# Altium project 210620_Corner_Board_R0.PrjPcb
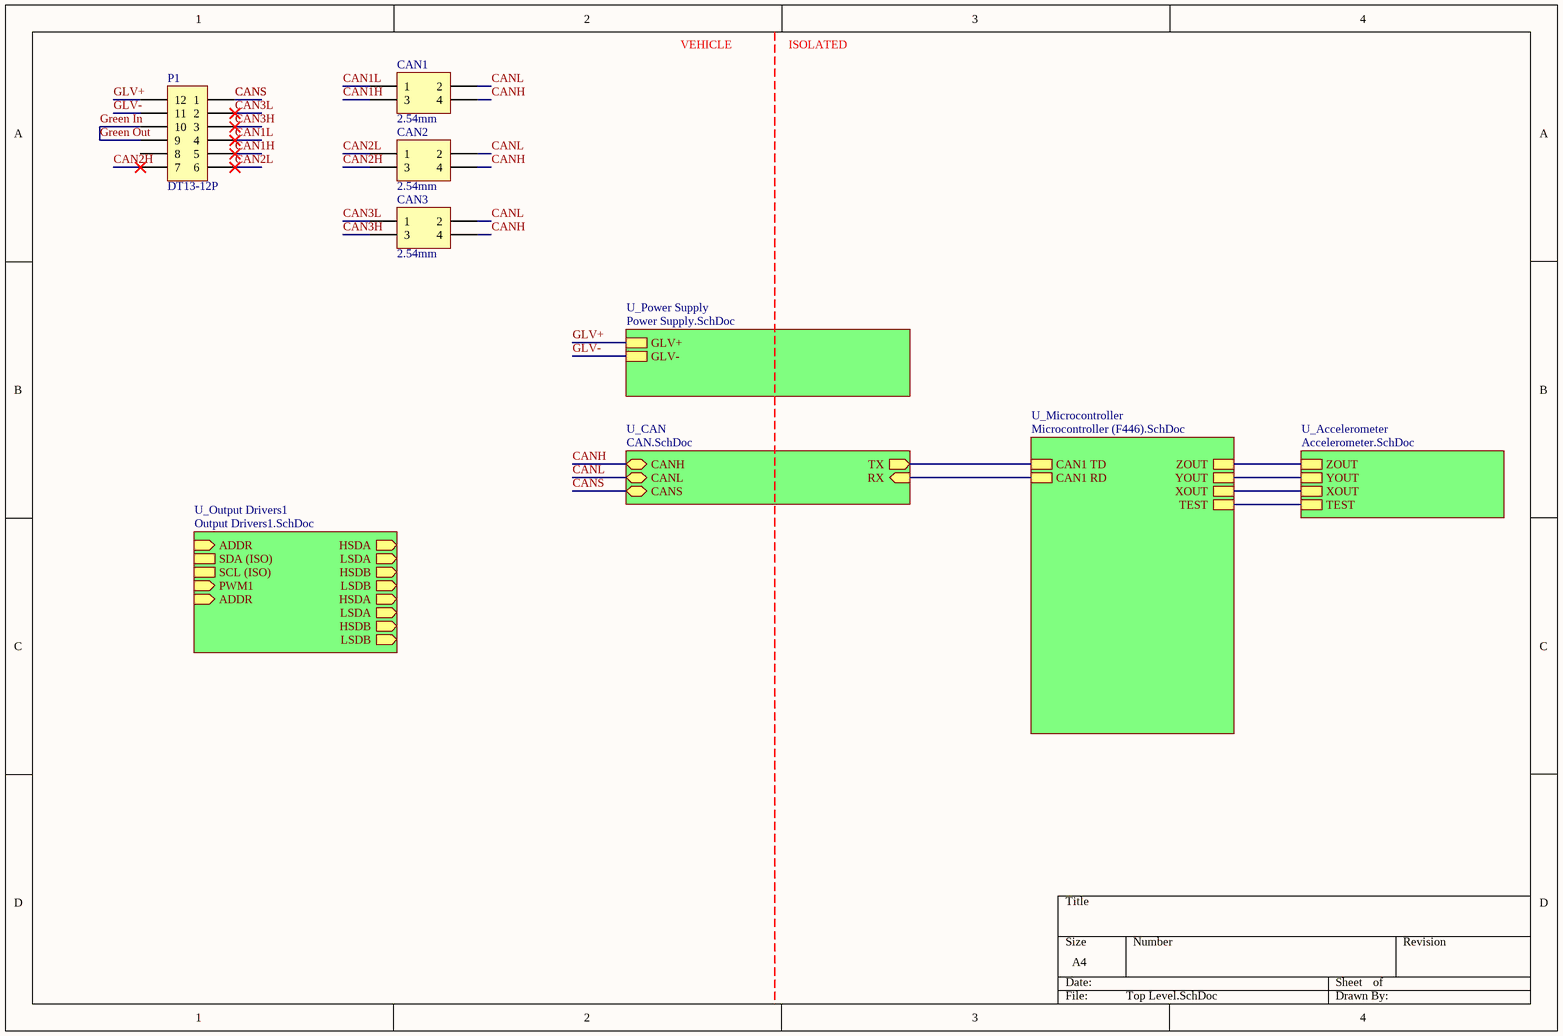
[diagram p0: Top Level.SchDoc]
6 sheets, 149 parts. Net scope: hierarchical (ports join the sheet entries above them; power ports are global).
Board file: 210627 CB R0.PcbDoc
Sheets:
  Top Level.SchDoc
    U_CAN = CAN.SchDoc
    U_Power Supply = Power Supply.SchDoc
    U_Microcontroller = Microcontroller (F446).SchDoc
    U_Accelerometer = Accelerometer.SchDoc
    U_Output Drivers1 = Output Drivers1.SchDoc

## Sheet Top Level.SchDoc
size A4; SheetNumber: 1; SheetTotal: 6

### Parts
CAN1  2.54mm  [TH 2.54mm Header 2x2]
CAN2  2.54mm  [TH 2.54mm Header 2x2]
CAN3  2.54mm  [TH 2.54mm Header 2x2]
P1  DT13-12P  [DT13-12P]

### Sub-sheets
U_Accelerometer = Accelerometer.SchDoc: ZOUT, XOUT, TEST, YOUT
U_CAN = CAN.SchDoc: CANS (bidir), RX (in), CANL (bidir), CANH (bidir), TX (out)
U_Microcontroller = Microcontroller (F446).SchDoc: CAN1 RD, CAN1 TD, ZOUT, XOUT, YOUT, TEST
U_Output Drivers1 = Output Drivers1.SchDoc: ADDR (in), HSDA (out), LSDA (out), HSDB (out), LSDB (out), SDA (ISO), SCL (ISO), PWM1 (in), HSDA (out), LSDA (out), HSDB (out), LSDB (out), ADDR (in)
U_Power Supply = Power Supply.SchDoc: GLV+, GLV-

### Nets
CANS: P1.1 ; sheet U_CAN/CANS
CAN1H: CAN1.3 P1.5
CAN1L: CAN1.1 P1.4
CAN2H: CAN2.3 P1.7
CAN2L: CAN2.1 P1.6
CAN3H: CAN3.3 P1.3
CAN3L: CAN3.1 P1.2
CANH: CAN1.4 CAN2.4 CAN3.4 ; sheet U_CAN/CANH
CANL: CAN1.2 CAN2.2 CAN3.2 ; sheet U_CAN/CANL
GLV+: P1.12 ; sheet U_Power Supply/GLV+
GLV-: P1.11 ; sheet U_Power Supply/GLV-
Green In: P1.9 P1.10  [also labelled Green Out]
NetTP15_1: sheet U_CAN/TX, sheet U_Microcontroller/CAN1 TD
NetTP16_1: sheet U_CAN/RX, sheet U_Microcontroller/CAN1 RD
NetU9_4: sheet U_Microcontroller/ZOUT, sheet U_Accelerometer/ZOUT
NetU9_5: sheet U_Microcontroller/YOUT, sheet U_Accelerometer/YOUT
NetU9_6: sheet U_Microcontroller/XOUT, sheet U_Accelerometer/XOUT
NetU9_7: sheet U_Microcontroller/TEST, sheet U_Accelerometer/TEST
NetU11_2: sheet U_Output Drivers1/LSDB, sheet U_Output Drivers1/LSDB
NetU11_11: sheet U_Output Drivers1/HSDB, sheet U_Output Drivers1/HSDB
NetU11_28: sheet U_Output Drivers1/LSDA, sheet U_Output Drivers1/LSDA
NetU13_11: sheet U_Output Drivers1/ADDR, sheet U_Output Drivers1/ADDR
(unnamed): sheet U_Output Drivers1/HSDA, sheet U_Output Drivers1/HSDA

Not connected (* = marked no-connect by the designer): P1 8

### Notes on the sheet
- VEHICLE
- ISOLATED

### Library data of the parts
CAN1-CAN3 = TH 2.54mm Header 2x2: Positions: 4; Angle: 0; Flange: No; Contact: NA; Part Number: TH 2.54mm Header 2x2; Pitch: 2.54mm; Row Spacing: 2.54mm
P1 = DT13-12P: Positions: 12; Pitch: 4.44mm; Row Spacing: 6.35mm; Angle: 90; Flange: Yes; Contact: Nickel; Part Number: DT13-12P; Digikey Part Number: 1734-1451-ND; Digikey Link: https://www.digikey.com.au/product-detail/en/te-connectivity-deutsch-connectors/DT13-12PA/1734-1451-ND/7220123

## Sheet CAN.SchDoc
size A4; SheetNumber: 3; SheetTotal: 6
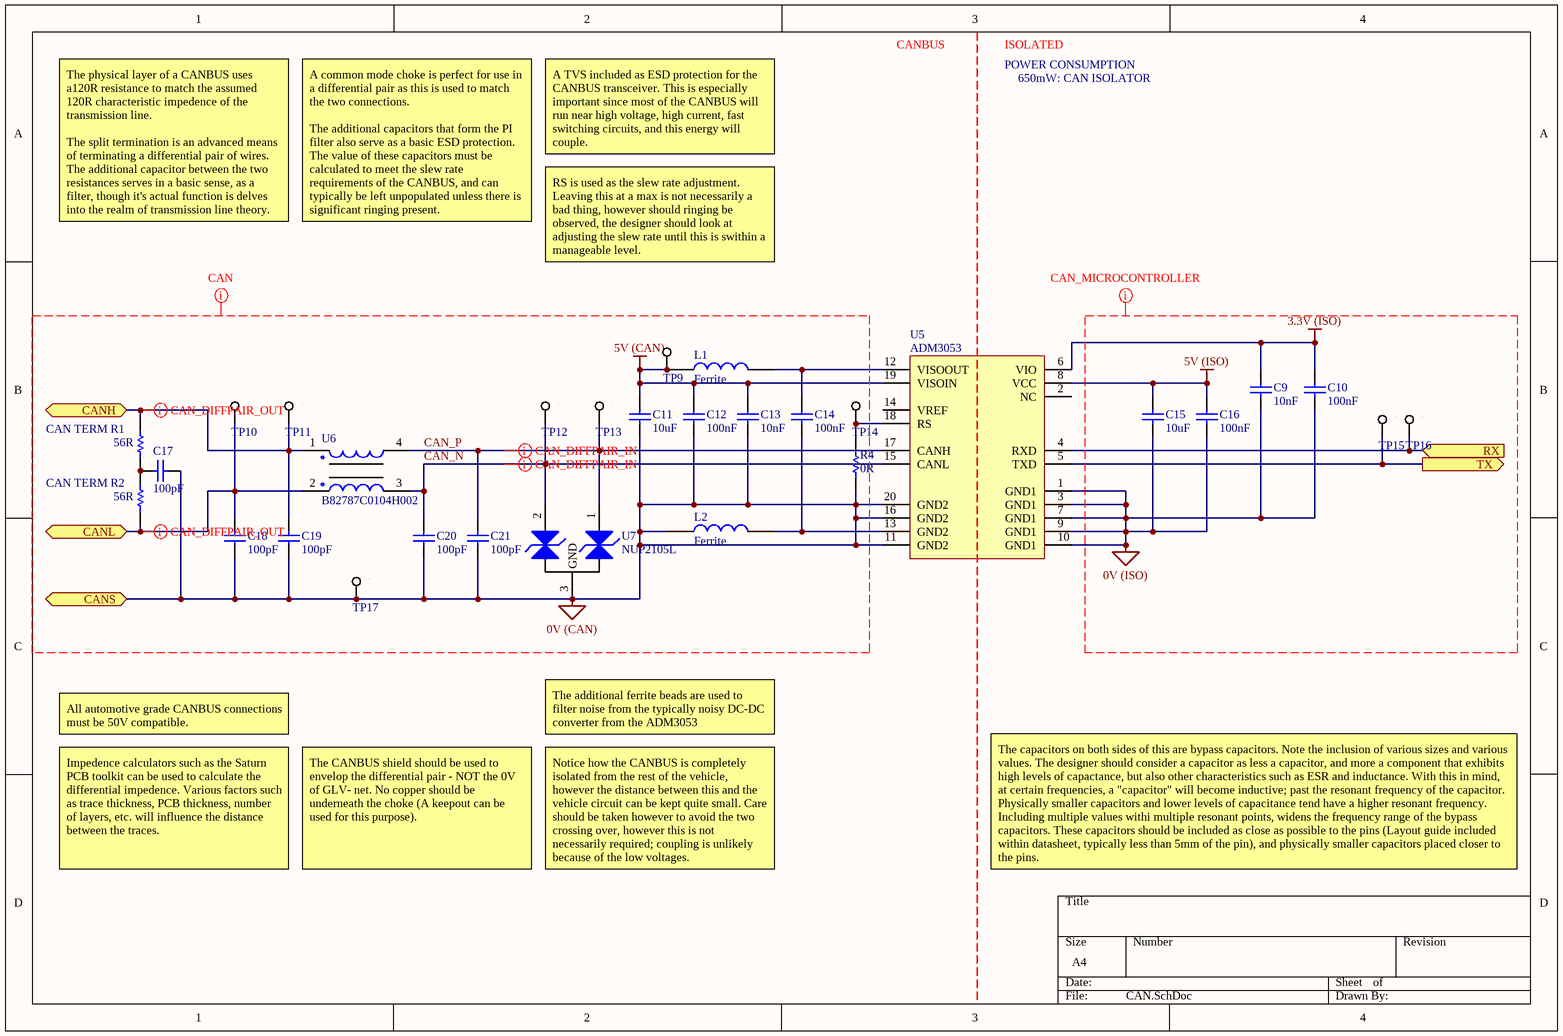
[diagram p1: CAN.SchDoc]

### Parts
(Parts that share a designator on the sheet are numbered #1, #2 ... from top to bottom, then left to right.)
C9  10nF  [1206]
C10  100nF  [0805]
C11  10uF  [0805]
C12  100nF  [0805]
C13  10nF  [1206]
C14  100nF  [0805]
C15  10uF  [0805]
C16  100nF  [0805]
C17  100pF  [0805]
C18  100pF  [0805]
C19  100pF  [0805]
C20  100pF  [0805]
C21  100pF  [0805]
CAN_TERM_R1  56R  [0805]
CAN_TERM_R2  56R  [0805]
L1  Ferrite  [0805]
L2  Ferrite  [0805]
R4#1  0R  [0805]
TP9  0mm  [SMD Test Point 1mm]  (value not drawn)
TP10  0mm  [SMD Test Point 1mm]  (value not drawn)
TP11  0mm  [SMD Test Point 1mm]  (value not drawn)
TP12  0mm  [SMD Test Point 1mm]  (value not drawn)
TP13  0mm  [SMD Test Point 1mm]  (value not drawn)
TP14  0mm  [SMD Test Point 1mm]  (value not drawn)
TP15  0mm  [SMD Test Point 1mm]  (value not drawn)
TP16  0mm  [SMD Test Point 1mm]  (value not drawn)
TP17  0mm  [SMD Test Point 1mm]  (value not drawn)
U5  ADM3053  [AD SOIC-W 20]
U6  B82787C0104H002  [TDK 4-PC Pad]
U7  NUP2105L  [ON SOT-23]

### Ports
CANH (bidir), CANL (bidir), CANS (bidir), RX (in), TX (out)

### Nets
0V (CAN): C11.1 C12.1 C13.1 C17.2 C18.1 C19.1 C20.1 C21.1 L2.2 R4#1.1 TP17.1 U5.11(GND2) U5.16(GND2) U5.20(GND2) U7.3(GND) ; port CANS  [project net CANS]
0V (ISO): C9.1 C10.1 C15.1 C16.1 U5.1(GND1) U5.3(GND1) U5.7(GND1) U5.9(GND1) U5.10(GND1)
3.3V (ISO): C9.2 C10.2 U5.6(VIO)
5V (CAN): C11.2 C12.2 C13.2 L1.2 TP9.1 U5.19(VISOIN)
5V (ISO): C15.2 C16.2 U5.8(VCC)
CAN_N: C20.2 TP12.1 U5.15(CANL) U6.3 U7.2(CAN_L)
CAN_P: C21.2 TP13.1 U5.17(CANH) U6.4 U7.1(CAN_H)
CANH: C19.2 CAN_TERM_R1.2 TP11.1 U6.1 ; port CANH
CANL: C18.2 CAN_TERM_R2.1 TP10.1 U6.2 ; port CANL
NetC14_1: C14.1 L2.1 U5.13(GND2)
NetC14_2: C14.2 L1.1 U5.12(VISOOUT)
NetC17_1: C17.1 CAN_TERM_R1.1 CAN_TERM_R2.2
NetR4#1_2: R4#1.2 TP14.1 U5.18(RS)
NetTP15_1: TP15.1 U5.5(TXD) ; port TX
NetTP16_1: TP16.1 U5.4(RXD) ; port RX

Not connected (* = marked no-connect by the designer): U5 2(NC) 14(VREF)

### Layout directives
net class CAN_NET: 0V (CAN), 5V (CAN), CAN_N, CAN_P
net class MICROCONTROLLER: 0V (ISO), 3.3V (ISO), 5V (ISO)
differential pair; differential pair class CAN_DIFFPAIR_IN: CAN_N, CAN_P
differential pair; differential pair class CAN_DIFFPAIR_OUT: CANH, CANL

### Notes on the sheet
- CANBUS
- ISOLATED
- POWER CONSUMPTION
- 650mW: CAN ISOLATOR
- A TVS included as ESD protection for the CANBUS transceiver. This is especially important since most of the CANBUS will run near high voltage, high current, fast switching circuits, and this energy will couple.
- The physical layer of a CANBUS uses a120R resistance to match the assumed 120R characteristic impedence of the transmission line.
  The split termination is an advanced means of terminating a differential pair of wires. The additional capacitor between the two resistances serves in a basic sense, as a filter, though it's actual function is delves into the realm of transmission line theory.
- A common mode choke is perfect for use in a differential pair as this is used to match the two connections.
  The additional capacitors that form the PI filter also serve as a basic ESD protection. The value of these capacitors must be calculated to meet the slew rate requirements of the CANBUS, and can typically be left unpopulated unless there is significant ringing present.
- RS is used as the slew rate adjustment. Leaving this at a max is not necessarily a bad thing, however should ringing be observed, the designer should look at adjusting the slew rate until this is swithin a manageable level.
- All automotive grade CANBUS connections must be 50V compatible.
- The additional ferrite beads are used to filter noise from the typically noisy DC-DC converter from the ADM3053
- Impedence calculators such as the Saturn PCB toolkit can be used to calculate the differential impedence. Various factors such as trace thickness, PCB thickness, number of layers, etc. will influence the distance between the traces.
- The CANBUS shield should be used to envelop the differential pair - NOT the 0V of GLV- net. No copper should be underneath the choke (A keepout can be used for this purpose).
- Notice how the CANBUS is completely isolated from the rest of the vehicle, however the distance between this and the vehicle circuit can be kept quite small. Care should be taken however to avoid the two crossing over, however this is not necessarily required; coupling is unlikely because of the low voltages.
- The capacitors on both sides of this are bypass capacitors. Note the inclusion of various sizes and various values. The designer should consider a capacitor as less a capacitor, and more a component that exhibits high levels of capactance, but also other characteristics such as ESR and inductance. With this in mind, at certain frequencies, a "capacitor" will become inductive; past the resonant frequency of the capacitor. Physically smaller capacitors and lower levels of capacitance tend have a higher resonant frequency. Including multiple values withi multiple resonant points, widens the frequency range of the bypass capacitors. These capacitors should be included as close as possible to the pins (Layout guide included within datasheet, typically less than 5mm of the pin), and physically smaller capacitors placed closer to the pins.

### Library data of the parts
C9 C13 = GCM3195C2A103JA16D: Manufacturer: muRata; Tolerance: 5%; Material: Ceramic; Rated Voltage: 100V; Part Number: GCM3195C2A103JA16D; Value: 10nF; Digikey Part Number: 490-4978-2-ND
C10 C12 C14 C16 = GCM21BR71E104KA37L: Manufacturer: muRata; Tolerance: 10%; Material: X7R; Rated Voltage: 25V; Part Number: GCM21BR71E104KA37L; Value: 100nF; Digikey Part Number: DO NOT USE FOR NEW DESIGNS
C11 C15 = GRM21BR6YA106KE43L: Manufacturer: muRata; Tolerance: 10%; Material: X5R; Rated Voltage: 50V; Part Number: GRM21BR6YA106KE43L; Value: 10uF; Digikey Part Number: 490-10514-6-ND
C17-C21 = GCM21B5C1H101JA37L: Manufacturer: muRata; Tolerance: 5%; Material: C0G; Rated Voltage: 50V; Part Number: GCM21B5C1H101JA37L; Value: 100pF; Digikey Part Number: DO NOT USE FOR NEW DESIGNS
CAN_TERM_R1 CAN_TERM_R2 = RC0805FR0756RL: Manufacturer: YAGEO; Tolerance: 0.01; Rated Voltage: 0.125W; Part Number: RC0805FR0756RL; Value: 56R; Material: FR-07; Digikey Part Number: 311-56.0CRCT-ND
L1 L2 = MMZ2012Y202BTD25: Manufacturer: TDK Corportation; Impedence: 2 kOhms @ 100MHz; Material: Ferrite Bead; Rated Current: 400mA; Part Number: MMZ2012Y202BTD25; Value: Ferrite; Digikey Part Number: 445-172872-1-ND
R4#1 = RC0805FR070RL: Manufacturer: YAGEO; Tolerance: 0.01; Rated Voltage: 0.125W; Part Number: RC0805FR070RL; Value: 0R; Material: FR-07; Digikey Part Number: 311-0.0CRCT-ND
TP9-TP17 = SMD Test Point Small: Positions: 1; Row Spacing: 0; Flange: No; Contact: NA; Part Number: SMD Test Point Small; Pitch: 0mm; Angle: 0
U5 = ADM3053: Isolated CAN Transceiver; Manufacturer: Analogue Devices; Part Number: ADM3053; Digikey Part Number: ADM3053BRWZ-ND; Digikey Link: https://www.digikey.com/product-detail/en/analog-devices-inc/ADM3053BRWZ/ADM3053BRWZ-ND/2709332
U6 = B82787C0104H002: 100µH @ 100kHz 2 Line Common Mode Choke Surface Mount 5.8 kOhms @ 10MHz 150mA DCR 2Ohm; Manufacturer: EPCOS (TDK); Part Number: B82787C0104H002; Impedence: 5.8 kOhms @ 10MHz; Material: Wirewound; Rated Current: 150mA; Digikey Part Number: 495-4598-1-ND; Digikey Link: https://www.digikey.com/product-detail/en/epcos-tdk/B82787C0104H002/495-4598-2-ND/3680998; Value: 100µH @ 100kHz
U7 = NUP2105L: Dual Line CAN Bus Protector; Manufacturer: ON Semiconductor; Part Number: NUP2105L; Digikey Part Number: NUP2105LT1GOSCT-ND; Digikey Link: https://www.digikey.com/product-detail/en/on-semiconductor/NUP2105LT1G/NUP2105LT1GOSCT-ND/1485001

## Sheet Power Supply.SchDoc
size A4; SheetNumber: 2; SheetTotal: 6
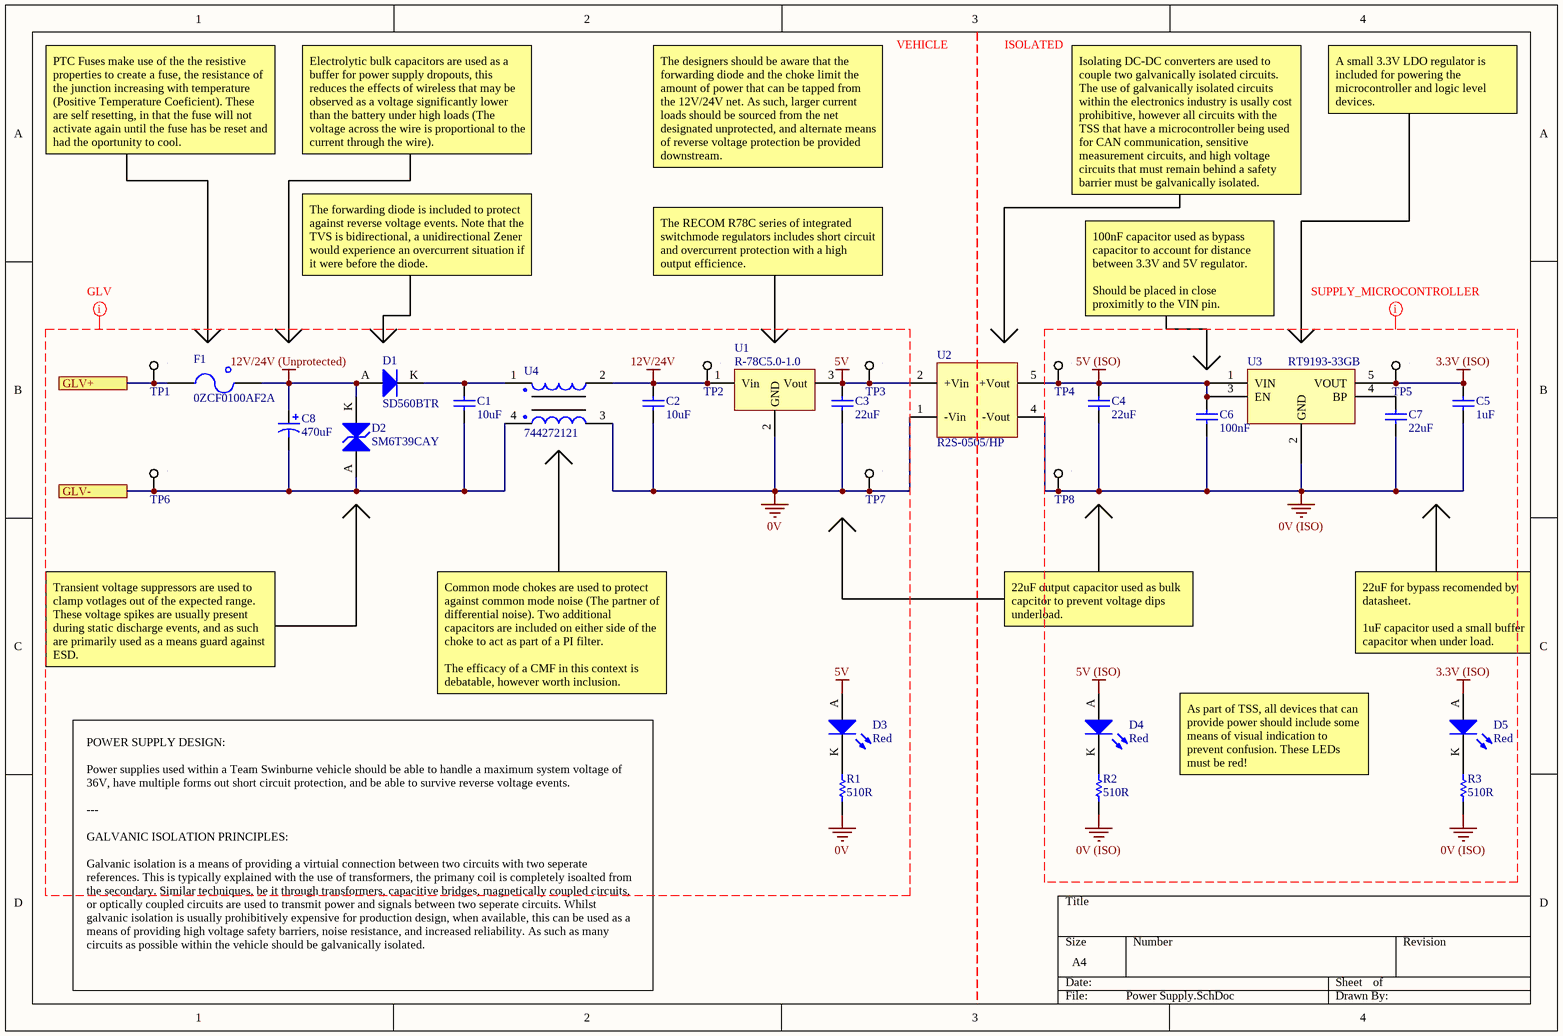
[diagram p2: Power Supply.SchDoc]

### Parts
(Parts that share a designator on the sheet are numbered #1, #2 ... from top to bottom, then left to right.)
C1  10uF  [0805]
C2  10uF  [0805]
C3  22uF  [1206]
C4  22uF  [1206]
C5  1uF  [0805]
C6  100nF  [0805]
C7  22uF  [1206]
C8  470uF  [Vishay Radial 1616]
D1  SD560BTR  [SMB Diode]
D2  SM6T39CAY  [ST SMB Diode]
D3  Red  [0805 LED]
D4  Red  [0805 LED]
D5#1  Red  [0805 LED]
F1  0ZCF0100AF2A  [2920]
R1  510R  [0805]
R2  510R  [0805]
R3  510R  [0805]
TP1  0mm  [SMD Test Point 1mm]  (value not drawn)
TP2  0mm  [SMD Test Point 1mm]  (value not drawn)
TP3  0mm  [SMD Test Point 1mm]  (value not drawn)
TP4  0mm  [SMD Test Point 1mm]  (value not drawn)
TP5  0mm  [SMD Test Point 1mm]  (value not drawn)
TP6  0mm  [SMD Test Point 1mm]  (value not drawn)
TP7  0mm  [SMD Test Point 1mm]  (value not drawn)
TP8  0mm  [SMD Test Point 1mm]  (value not drawn)
U1  R-78C5.0-1.0  [RECOM 3-SIP]
U2  R2S-0505/HP  [RECOM 8-SMD (5 Pin)]
U3  RT9193-33GB  [RICHTEK SOT-23-5]
U4  744272121  [Wurth 4-PC Pad]

### Ports
GLV+, GLV-

### Nets
0V: C2.1 C3.1 R1.1 TP7.1 U1.2(GND) U2.1(-Vin) U4.3
0V (ISO): C4.1 C5.1 C6.1 C7.1 R2.1 R3.1 TP8.1 U2.4(-Vout) U3.2(GND)
3.3V (ISO): C5.2 D5#1.A TP5.1 U3.5(VOUT)
5V: C3.2 D3.A TP3.1 U1.3(Vout) U2.2(+Vin)
5V (ISO): C4.2 C6.2 D4.A TP4.1 U2.5(+Vout) U3.1(VIN) U3.3(EN)
12V/24V: C2.2 TP2.1 U1.1(Vin) U4.2
12V/24V (Unprotected): C8.2 D1.A D2.K F1.2
GLV+: F1.1 TP1.1 ; port GLV+
GLV-: C1.1 C8.1 D2.A TP6.1 U4.4 ; port GLV-
NetC1_2: C1.2 D1.K U4.1
NetC7_2: C7.2 U3.4(BP)
NetD3_K: D3.K R1.2
NetD4_K: D4.K R2.2
NetD5#1_K: D5#1.K R3.2

### Layout directives
net class GLV: 0V, 5V, 12V/24V, 12V/24V (Unprotected)
net class MICROCONTROLLER: 0V (ISO), 3.3V (ISO), 5V (ISO)

### Notes on the sheet
- VEHICLE
- ISOLATED
- A small 3.3V LDO regulator is included for powering the microcontroller and logic level devices.
- PTC Fuses make use of the the resistive properties to create a fuse, the resistance of the junction increasing with temperature (Positive Temperature Coeficient). These are self resetting, in that the fuse will not activate again until the fuse has be reset and had the oportunity to cool.
- Electrolytic bulk capacitors are used as a buffer for power supply dropouts, this reduces the effects of wireless that may be observed as a voltage significantly lower than the battery under high loads (The voltage across the wire is proportional to the current through the wire).
- The designers should be aware that the forwarding diode and the choke limit the amount of power that can be tapped from the 12V/24V net. As such, larger current loads should be sourced from the net designated unprotected, and alternate means of reverse voltage protection be provided downstream.
- Isolating DC-DC converters are used to couple two galvanically isolated circuits.
  The use of galvanically isolated circuits within the electronics industry is usally cost prohibitive, however all circuits with the TSS that have a microcontroller being used for CAN communication, sensitive measurement circuits, and high voltage circuits that must remain behind a safety barrier must be galvanically isolated.
- The forwarding diode is included to protect against reverse voltage events. Note that the TVS is bidirectional, a unidirectional Zener would experience an overcurrent situation if it were before the diode.
- The RECOM R78C series of integrated switchmode regulators includes short circuit and overcurrent protection with a high output efficience.
- 100nF capacitor used as bypass capacitor to account for distance between 3.3V and 5V regulator.
  Should be placed in close proximitly to the VIN pin.
- 22uF output capacitor used as bulk capcitor to prevent voltage dips underload.
- 22uF for bypass recomended by datasheet.
  1uF capacitor used a small buffer capacitor when under load.
- Transient voltage suppressors are used to clamp votlages out of the expected range. These voltage spikes are usually present during static discharge events, and as such are primarily used as a means guard against ESD.
- Common mode chokes are used to protect against common mode noise (The partner of differential noise). Two additional capacitors are included on either side of the choke to act as part of a PI filter.
  The efficacy of a CMF in this context is debatable, however worth inclusion.
- As part of TSS, all devices that can provide power should include some means of visual indication to prevent confusion. These LEDs must be red!
- POWER SUPPLY DESIGN:
  Power supplies used within a Team Swinburne vehicle should be able to handle a maximum system voltage of 36V, have multiple forms out short circuit protection, and be able to survive reverse voltage events.
  ---
  GALVANIC ISOLATION PRINCIPLES:
  Galvanic isolation is a means of providing a virtuial connection between two circuits with two seperate references. This is typically explained with the use of transformers, the primany coil is completely isoalted from the secondary. Similar techniques, be it through transformers, capacitive bridges, magnetically coupled circuits, or optically coupled circuits are used to transmit power and signals between two seperate circuits. Whilst galvanic isolation is usually prohibitively expensive for production design, when available, this can be used as a means of providing high voltage safety barriers, noise resistance, and increased reliability. As such as many circuits as possible within the vehicle should be galvanically isolated.

### Library data of the parts
C1 C2 = GRM21BR6YA106KE43L: as C11 on sheet CAN; Part Number: GRM21BR6YA106KE43L; Value: 10uF; Digikey Part Number: 490-10514-6-ND
C3 C4 C7 = CC1206MKX5R7BB226: Manufacturer: YAGEO; Tolerance: 20%; Material: Ceramic; Rated Voltage: 16V; Part Number: CC1206MKX5R7BB226; Value: 22uF; Digikey Part Number: 311-1997-2-ND
C5 = AC0805KKX7R8BB105: Manufacturer: YAGEO; Tolerance: 10%; Material: X7R; Rated Voltage: 25V; Part Number: AC0805KKX7R8BB105; Value: 1uF; Digikey Part Number: DO NOT USE FOR NEW DESIGNS
C6 = GCM21BR71E104KA37L: as C10 on sheet CAN; Part Number: GCM21BR71E104KA37L; Value: 100nF; Digikey Part Number: DO NOT USE FOR NEW DESIGNS
C8 = MAL214699108E3: Manufacturer: Vishay; Tolerance: 20%; Material: Aluminium Electrolytic; Rated Voltage: 50V; Part Number: MAL214699108E3; Value: 470uF; Digikey Part Number: 4442PHCT-ND
D1 = SD560BTR: 1.2V_F 600V 5A SMB; Manufacturer: SMC Diode Solutions; Part Number: SD560BTR; Digikey Part Number: 1655-1530-2-ND; Digikey Link: https://www.digikey.com/product-detail/en/smc-diode-solutions/SD560BTR/1655-1530-2-ND/6022620
D2 = SM6T39CAY: 42.8V Clamp 93A (8/20µs) Ipp Tvs Diode Surface Mount SMB (DO-214AA); Manufacturer: ST; Vf: 42.8; Part Number: SM6T39CAY; Vbr: 42.8V; Digikey Part Number: SM6T39CAY; Digikey Link: https://www.digikey.com/en/products/detail/stmicroelectronics/SM6T39CAY/2442903; Alternative Parts: https://www.digikey.com/en/products/detail/stmicroelectronics/SM6T39AY/2442901
D3 D4 D5#1 = SML-210LTT86: Red LED Indication - Discrete 1.75V 0805 (2012 Metric); Manufacturer: ROHM Semiconductor; Part Number: SML-210LTT86; Colour: Red; Digikey Part Number: 511-1286-1-ND; Digikey Link: https://www.digikey.com/product-detail/en/rohm-semiconductor/SML-210LTT86/511-1286-1-ND/637099
F1 = 0ZCF0100AF2A: PTC RESET FUSE 60V 1A 292; Manufacturer: Littelfuse Inc.; Part Number: 0ZCF0100AF2A; Digikey Part Number: 507-2070-1-ND; Digikey Link: https://www.digikey.com/product-detail/en/bel-fuse-inc/0ZCF0100AF2A/507-2070-1-ND/6210547
R1-R3 = RC0805FR07510RL: Manufacturer: YAGEO; Tolerance: 0.01; Rated Voltage: 0.125W; Part Number: RC0805FR07510RL; Value: 510R; Material: FR-07; Digikey Part Number: 311-510CRCT-ND
TP1-TP8 = SMD Test Point Small: as TP9 on sheet CAN; Part Number: SMD Test Point Small; Pitch: 0mm; Angle: 0
U1 = R-78C5.0-1.0: CONV DC/DC 1A 5V OUT SIP VERT; Manufacturer: Recom; Isolation: Non-Isolated; Output Power: 5W; Part Number: R-78C5.0-1.0; Digikey Part Number: 945-1395-5-ND; Digikey Link: https://www.digikey.com.au/product-detail/en/recom-power/R-78C5.0-1.0/945-1395-5-ND/2652148; Output Voltage: 5V
U2 = R2S-0505/HP: Isolated Module DC DC Converter 1 Output 3.3V 606mA 4.5V - 5.5V Input; Manufacturer: Recom; Output Voltage: 5V; Output Power: 2W; Efficiency: 0.85; Part Number: R2S-0505/HP; Input Voltage: 4.5V-5.5V; Isolation: Isolated; Digikey Part Number: 945-1764-5-ND; Digikey Link: https://www.digikey.com/product-detail/en/recom-power/R2S-0505-HP/945-1764-5-ND/2302761
U3 = RT9193-33GB: Linear Voltage Regulator IC 1 Output 300mA SOT-23-5; Manufacturer: Richtek; Input Voltage: 5.5V-0.3V; Output Voltage: 3.3V; Output Power: 1W; Efficiency: 0.5; Isolation: Non-Isolated; Part Number: RT9193-33GB; Digikey Part Number: 1028-1014-1-ND; Digikey Link: https://www.digikey.com/products/en?keywords=1028-1014-1-ND
U4 = 744272121: 120µH @ 100kHz 2 Line Common Mode Choke Surface Mount 460 Ohms @ 30MHz 2.5A DCR 25mOhm; Manufacturer: Wurth Electronics Inc; Value: 120uH @ 100kHz; Part Number: 744272121; Impedence: 460 Ohms @ 30MHz; Material: Wirewound; Rated Current: 2.5A; Digikey Part Number: 732-1489-1-ND; Digikey Link: https://www.digikey.com/product-detail/en/w-rth-elektronik/744272121/732-1489-1-ND/1639501

## Sheet Microcontroller (F446).SchDoc
size A3; SheetNumber: 4; SheetTotal: 6
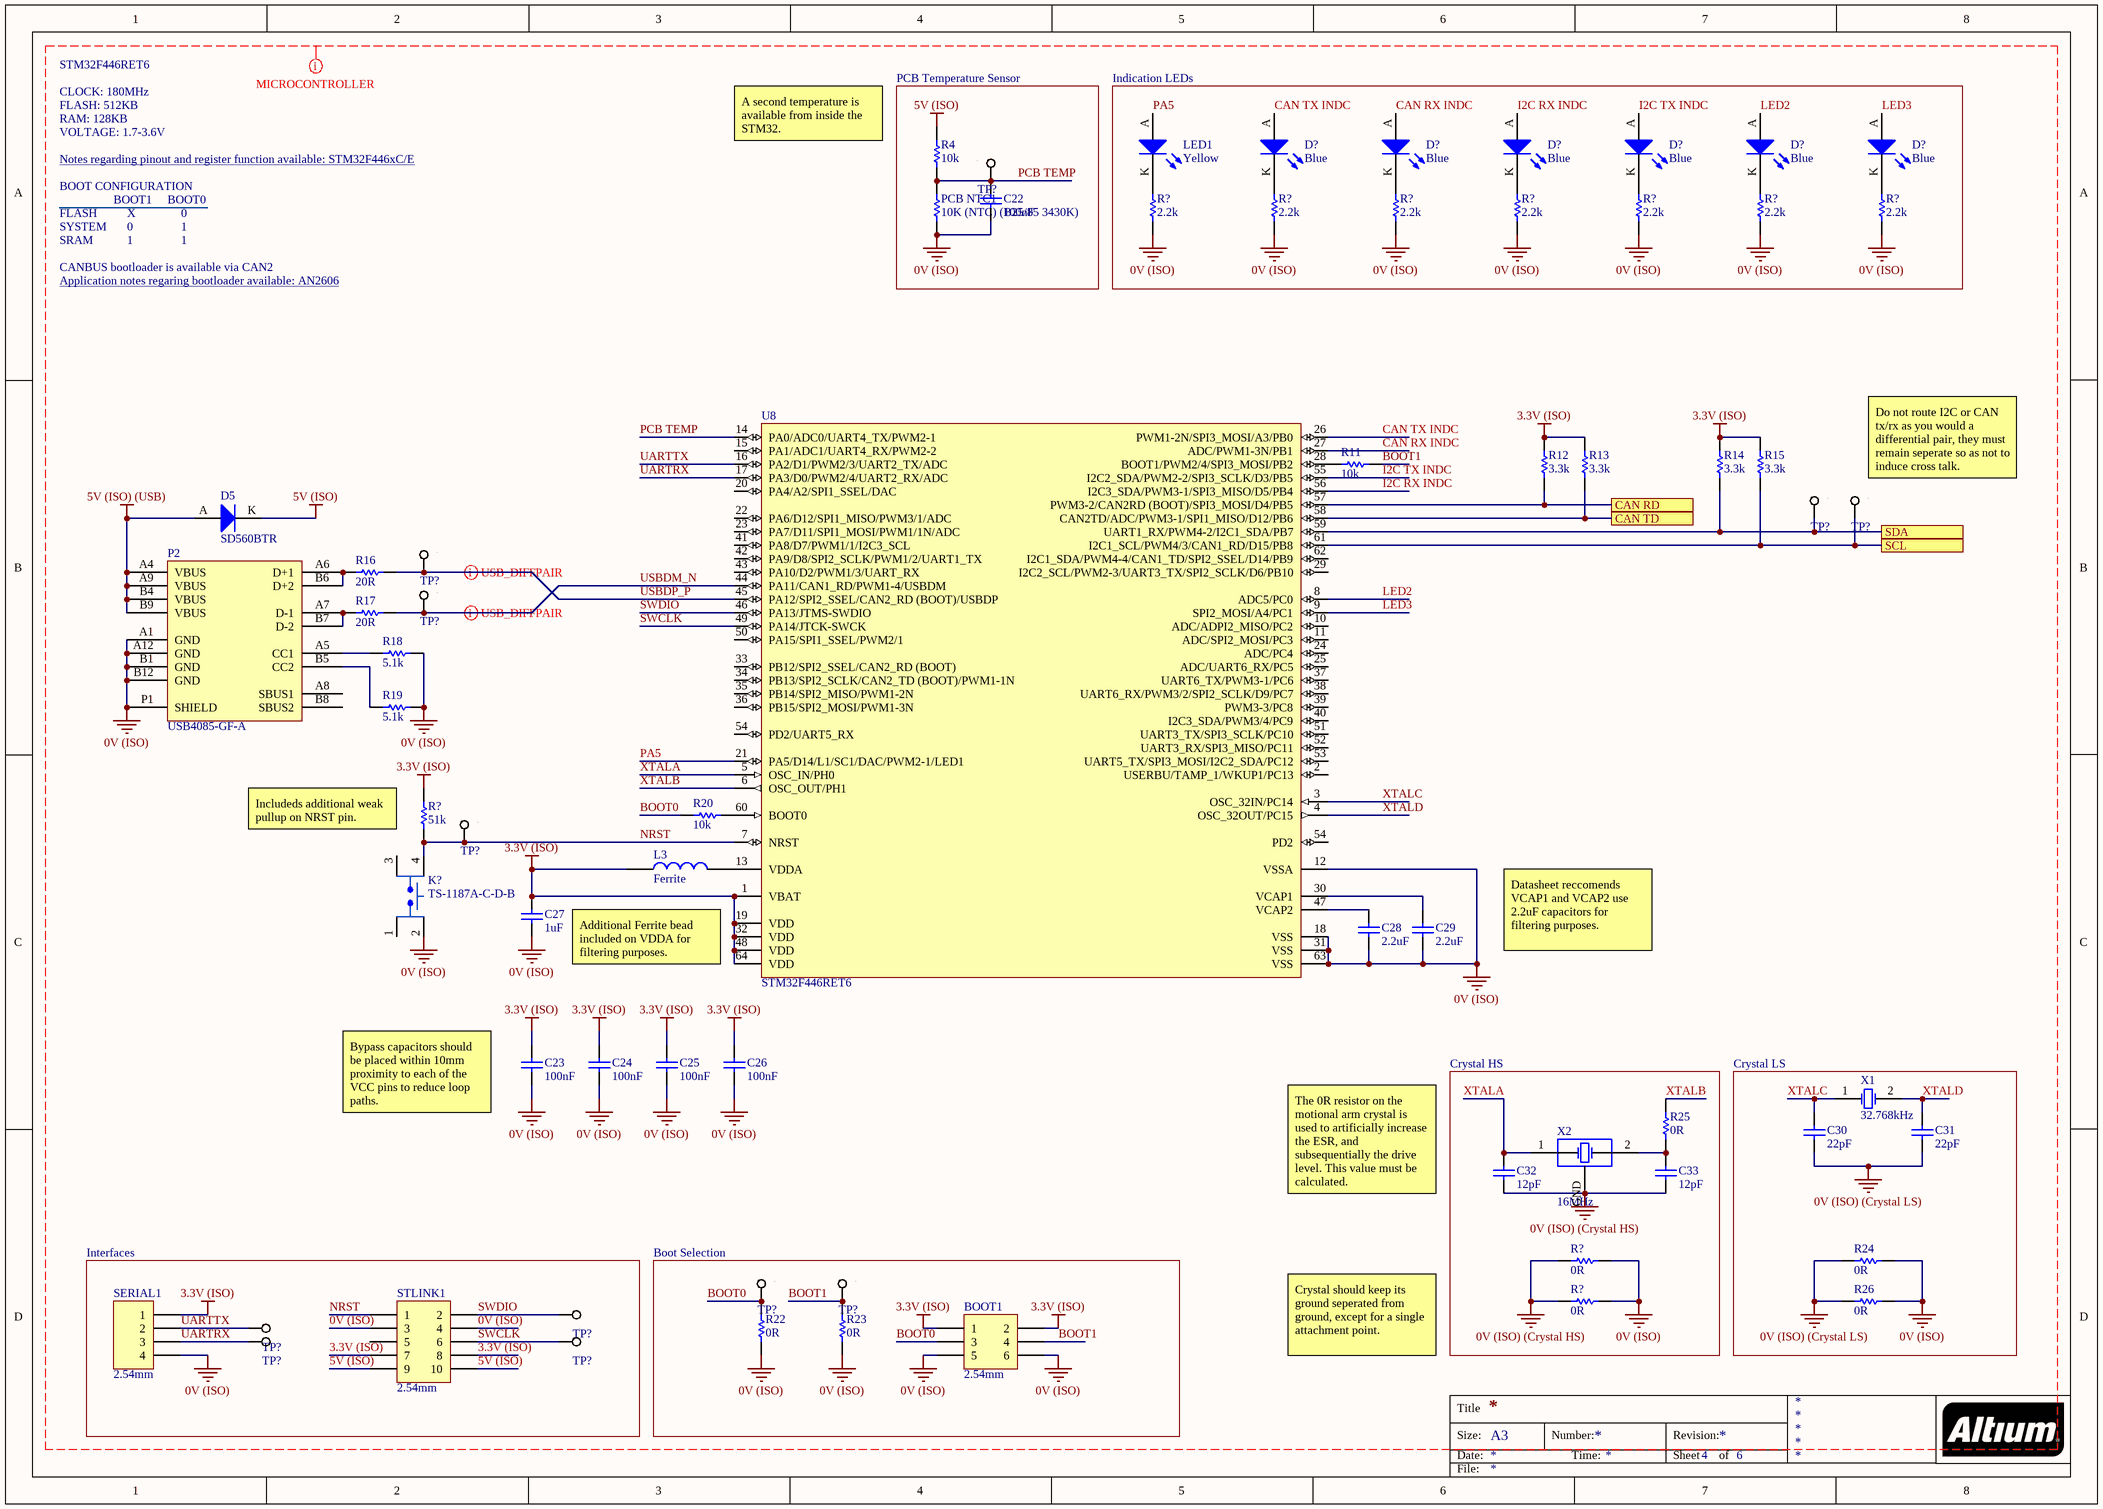
[diagram p3: Microcontroller (F446).SchDoc]

### Parts
(Parts that share a designator on the sheet are numbered #1, #2 ... from top to bottom, then left to right.)
BOOT1  2.54mm  [TH 2.54mm Header 2x3]
C22  100nF  [0805]
C23  100nF  [0805]
C24  100nF  [0805]
C25  100nF  [0805]
C26  100nF  [0805]
C27  1uF  [0805]
C28  2.2uF  [0805]
C29  2.2uF  [0805]
C30  22pF  [0805]
C31  22pF  [0805]
C32  12pF  [0805]
C33  12pF  [0805]
D5#2  SD560BTR  [SMB Diode]
D?#1  Blue  [0805 LED]
D?#2  Blue  [0805 LED]
D?#3  Blue  [0805 LED]
D?#4  Blue  [0805 LED]
D?#5  Blue  [0805 LED]
D?#6  Blue  [0805 LED]
K?  TS-1187A-C-D-B  [XKB SW-4.5]
L3  Ferrite  [0805]
LED1  Yellow  [0805 LED]
P2  USB4085-GF-A  [USB4085-GF-A]
PCB_NTC1  10K (NTC) (B25/85 3430K)  [0805]
R4#2  10k  [0805]
R11  10k  [0805]
R12  3.3k  [0805]
R13  3.3k  [0805]
R14  3.3k  [0805]
R15  3.3k  [0805]
R16  20R  [0805]
R17  20R  [0805]
R18  5.1k  [0805]
R19  5.1k  [0805]
R20  10k  [0805]
R22  0R  [0805]
R23  0R  [0805]
R24  0R  [0805]
R25  0R  [0805]
R26  0R  [0805]
R?#1  2.2k  [0805]
R?#2  2.2k  [0805]
R?#3  2.2k  [0805]
R?#4  2.2k  [0805]
R?#5  2.2k  [0805]
R?#6  2.2k  [0805]
R?#7  2.2k  [0805]
R?#8  51k  [0805]
R?#9  0R  [0805]
R?#10  0R  [0805]
SERIAL1  2.54mm  [TH 2.54mm Header 1x4]
STLINK1  2.54mm  [TH 2.54mm Header 2x5]
TP?#1  0mm  [SMD Test Point 1mm]  (value not drawn)
TP?#2  0mm  [SMD Test Point 1mm]  (value not drawn)
TP?#3  0mm  [SMD Test Point 1mm]  (value not drawn)
TP?#4  0mm  [SMD Test Point 1mm]  (value not drawn)
TP?#5  0mm  [SMD Test Point 1mm]  (value not drawn)
TP?#6  0mm  [SMD Test Point 1mm]  (value not drawn)
TP?#7  0mm  [SMD Test Point 1mm]  (value not drawn)
TP?#8  0mm  [SMD Test Point 1mm]  (value not drawn)
TP?#9  0mm  [SMD Test Point 1mm]  (value not drawn)
TP?#10  0mm  [SMD Test Point 1mm]  (value not drawn)
TP?#11  0mm  [SMD Test Point 1mm]  (value not drawn)
TP?#12  0mm  [SMD Test Point 1mm]  (value not drawn)
U8  STM32F446RET6  [STM 64-LQFP]
X1  32.768kHz  [EPSON 2-SMD]
X2  16MHz  [Abracon 4-SMD 3.2x2.5]

### Blocks framed on the sheet
PCB Temperature Sensor: C22 PCB_NTC1 R4#2 TP?#1
Indication LEDs: D?#1-D?#6 LED1 R?#1-R?#7
Crystal HS: C32 C33 R25 R?#9 R?#10 X2
Crystal LS: C30 C31 R24 R26 X1
Interfaces: SERIAL1 STLINK1 TP?#9-TP?#12
Boot Selection: BOOT1 R22 R23 TP?#7 TP?#8

### Ports
CAN RD, CAN TD, SCL, SDA

### Nets
0V (ISO): BOOT1.5 BOOT1.6 C22.1 C23.1 C24.1 C25.1 C26.1 C27.1 C28.1 C29.1 K?.2(VDD) P2.A1(GND) P2.A12(GND) P2.B1(GND) P2.B12(GND) P2.P1(SHIELD) PCB_NTC1.1 R18.2 R19.2 R22.1 R23.1 R24.1 R26.1 R?#1.1 R?#2.1 R?#3.1 R?#4.1 R?#5.1 R?#6.1 R?#7.1 R?#9.1 R?#10.1 SERIAL1.4 STLINK1.3 STLINK1.4 U8.12(VSSA) U8.18(VSS) U8.31(VSS) U8.63(VSS)
0V (ISO) (Crystal HS): C32.1 C33.1 R?#9.2 R?#10.2 X2.GND
0V (ISO) (Crystal LS): C30.1 C31.1 R24.2 R26.2
3.3V (ISO): BOOT1.1 BOOT1.2 C23.2 C24.2 C25.2 C26.2 C27.2 L3.2 R12.2 R13.2 R14.2 R15.2 R?#8.2 SERIAL1.1 STLINK1.7 STLINK1.8 U8.1(VBAT) U8.19(VDD) U8.32(VDD) U8.48(VDD) U8.64(VDD)
5V (ISO): D5#2.K R4#2.2 STLINK1.9 STLINK1.10
5V (ISO) (USB): D5#2.A P2.A4(VBUS) P2.A9(VBUS) P2.B4(VBUS) P2.B9(VBUS)
BOOT0: BOOT1.3 R20.1 R22.2 TP?#7.1
BOOT1: BOOT1.4 R11.2 R23.2 TP?#8.1
CAN RX INDC: D?#2.A U8.27(ADC/PWM1-3N/PB1)
CAN TX INDC: D?#1.A U8.26(PWM1-2N/SPI3_MOSI/A3/PB0)
I2C RX INDC: D?#3.A U8.56(I2C3_SDA/PWM3-1/SPI3_MISO/D5/PB4)
I2C TX INDC: D?#4.A U8.55(I2C2_SDA/PWM2-2/SPI3_SCLK/D3/PB5)
LED2: D?#5.A U8.8(ADC5/PC0)
LED3: D?#6.A U8.9(SPI2_MOSI/A4/PC1)
NRST: K?.4(VDD) R?#8.1 STLINK1.1 TP?#6.1 U8.7(NRST)
PA5: LED1.A U8.21(PA5/D14/L1/SC1/DAC/PWM2-1/LED1)
PCB TEMP: C22.2 PCB_NTC1.2 R4#2.1 TP?#1.1 U8.14(PA0/ADC0/UART4_TX/PWM2-1)
SWCLK: STLINK1.6 TP?#12.1 U8.49(PA14/JTCK-SWCK)
SWDIO: STLINK1.2 TP?#9.1 U8.46(PA13/JTMS-SWDIO)
UARTRX: SERIAL1.3 TP?#11.1 U8.17(PA3/D0/PWM2/4/UART2_RX/ADC)
UARTTX: SERIAL1.2 TP?#10.1 U8.16(PA2/D1/PWM2/3/UART2_TX/ADC)
USBDM_N: R17.2 TP?#5.1 U8.44(PA11/CAN1_RD/PWM1-4/USBDM)
USBDP_P: R16.2 TP?#4.1 U8.45(PA12/SPI2_SSEL/CAN2_RD_(BOOT)/USBDP)
XTALA: C32.2 U8.5(OSC_IN/PH0) X2.1(OSC1)
XTALB: R25.2 U8.6(OSC_OUT/PH1)
XTALC: C30.2 U8.3(OSC_32IN/PC14) X1.1(OSC1)
XTALD: C31.2 U8.4(OSC_32OUT/PC15) X1.2(OSC2)
NetC28_2: C28.2 U8.47(VCAP2)
NetC29_2: C29.2 U8.30(VCAP1)
NetC33_2: C33.2 R25.1 X2.2(OSC2)
NetD?#1_K: D?#1.K R?#2.2
NetD?#2_K: D?#2.K R?#3.2
NetD?#3_K: D?#3.K R?#4.2
NetD?#4_K: D?#4.K R?#5.2
NetD?#5_K: D?#5.K R?#6.2
NetD?#6_K: D?#6.K R?#7.2
NetL3_1: L3.1 U8.13(VDDA)
NetLED1_K: LED1.K R?#1.2
NetP2_A5: P2.A5(CC1) R18.1
NetP2_A6: P2.A6(D+1) P2.B6(D+2) R16.1
NetP2_A7: P2.A7(D-1) P2.B7(D-2) R17.1
NetP2_B5: P2.B5(CC2) R19.1
NetR11_1: R11.1 U8.28(BOOT1/PWM2/4/SPI3_MOSI/PB2)
NetR12_1: R12.1 U8.57(PWM3-2/CAN2RD_(BOOT)/SPI3_MOSI/D4/PB5) ; port CAN RD
NetR13_1: R13.1 U8.58(CAN2TD/ADC/PWM3-1/SPI1_MISO/D12/PB6) ; port CAN TD
NetR14_1: R14.1 TP?#2.1 U8.59(UART1_RX/PWM4-2/I2C1_SDA/PB7) ; port SDA
NetR15_1: R15.1 TP?#3.1 U8.61(I2C1_SCL/PWM4/3/CAN1_RD/D15/PB8) ; port SCL
NetR20_2: R20.2 U8.60(BOOT0)

Not connected (* = marked no-connect by the designer): K? 1(VDD) 3(VDD); P2 A8(SBUS1) B8(SBUS2); STLINK1 5; U8 2(USERBU/TAMP_1/WKUP1/PC13) 10(ADC/ADPI2_MISO/PC2) 11(ADC/SPI2_MOSI/PC3) 15(PA1/ADC1/UART4_RX/PWM2-2) 20(PA4/A2/SPI1_SSEL/DAC) 22(PA6/D12/SPI1_MISO/PWM3/1/ADC) 23(PA7/D11/SPI1_MOSI/PWM1/1N/ADC) 24(ADC/PC4) 25(ADC/UART6_RX/PC5) 29(I2C2_SCL/PWM2-3/UART3_TX/SPI2_SCLK/D6/PB10) 33(PB12/SPI2_SSEL/CAN2_RD_(BOOT)) 34(PB13/SPI2_SCLK/CAN2_TD_(BOOT)/PWM1-1N) 35(PB14/SPI2_MISO/PWM1-2N) 36(PB15/SPI2_MOSI/PWM1-3N) 37(UART6_TX/PWM3-1/PC6) 38(UART6_RX/PWM3/2/SPI2_SCLK/D9/PC7) 39(PWM3-3/PC8) 40(I2C3_SDA/PWM3/4/PC9) 41(PA8/D7/PWM1/1/I2C3_SCL) 42(PA9/D8/SPI2_SCLK/PWM1/2/UART1_TX) 43(PA10/D2/PWM1/3/UART_RX) 50(PA15/SPI1_SSEL/PWM2/1) 51(UART3_TX/SPI3_SCLK/PC10) 52(UART3_RX/SPI3_MISO/PC11) 53(UART5_TX/SPI3_MOSI/I2C2_SDA/PC12) 54(PD2) 62(I2C1_SDA/PWM4-4/CAN1_TD/SPI2_SSEL/D14/PB9)

### Layout directives
differential pair; differential pair class USB_DIFFPAIR: USBDM_N, USBDP_P
net class MICROCONTROLLER: 0V (ISO), 0V (ISO) (Crystal HS), 0V (ISO) (Crystal LS), 3.3V (ISO), 5V (ISO), 5V (ISO) (USB), BOOT0, BOOT1, CAN RX INDC, CAN TX INDC, I2C RX INDC, I2C TX INDC, LED2, LED3, NRST, PA5, PCB TEMP, SWCLK, SWDIO, UARTRX, UARTTX, USBDM_N, USBDP_P, XTALA, XTALB, XTALC, XTALD

### Notes on the sheet
- STM32F446RET6
- CLOCK: 180MHz
- FLASH: 512KB
- Notes regarding pinout and register function available: STM32F446xC/E <https://www.st.com/content/ccc/resource/technical/document/datasheet/65/cb/75/50/53/d6/48/24/DM00141306.pdf/files/DM00141306.pdf/jcr:content/translations/en.DM00141306.pdf>
- RAM: 128KB
- VOLTAGE: 1.7-3.6V
- A second temperature is available from inside the STM32.
- BOOT CONFIGURATION
- FLASH
- SYSTEM
- SRAM
- BOOT1
- X
- 1
- 0
- BOOT0
- CANBUS bootloader is available via CAN2
- Application notes regaring bootloader available: AN2606 <https://www.st.com/resource/en/application_note/cd00167594-stm32-microcontroller-system-memory-boot-mode-stmicroelectronics.pdf>
- (near TP?#3) Do not route I2C or CAN tx/rx as you would a differential pair, they must remain seperate so as not to induce cross talk.
- (near R?#8) Includeds additional weak pullup on NRST pin.
- Additional Ferrite bead included on VDDA for filtering purposes.
- Datasheet reccomends VCAP1 and VCAP2 use 2.2uF capacitors for filtering purposes.
- (near C23) Bypass capacitors should be placed within 10mm proximity to each of the VCC pins to reduce loop paths.
- The 0R resistor on the motional arm crystal is used to artificially increase the ESR, and subsequentially the drive level. This value must be calculated.
- Crystal should keep its ground seperated from ground, except for a single attachment point.
- Title
- Size:
- Date:
- A3
- Number:
- Time:
- Revision:
- Sheet
- of
- File:

### Library data of the parts
BOOT1 = TH 2.54mm Header 2x3: Positions: 6; Angle: 0; Flange: No; Contact: NA; Part Number: TH 2.54mm Header 2x3; Pitch: 2.54mm; Row Spacing: 2.54mm
C22 = GCM21BR71E104KA37L: as C10 on sheet CAN; Part Number: GCM21BR71E104KA37L; Value: 100nF; Digikey Part Number: DO NOT USE FOR NEW DESIGNS
C23-C26 = GCM21BR71H104KA37L: Manufacturer: muRata; Tolerance: ±10%; Material: X7R; Rated Voltage: 50V; Part Number: GCM21BR71H104KA37L; Value: 100nF; Digikey Part Number: 490-6064-1-ND
C27 = AC0805KKX7R8BB105: as C5 on sheet Power Supply; Part Number: AC0805KKX7R8BB105; Value: 1uF; Digikey Part Number: DO NOT USE FOR NEW DESIGNS
C28 C29 = GCM21BR61C225KA37L: Manufacturer: muRata; Tolerance: 10%; Material: X5R; Rated Voltage: 16V; Part Number: GCM21BR61C225KA37L; Value: 2.2uF; Digikey Part Number: DO NOT USE FOR NEW DESIGNS
C30 C31 = GRM21A5C2E220JW01D: Manufacturer: muRata; Tolerance: ±5%; Material: C0G, NP0; Rated Voltage: 250V; Part Number: GRM21A5C2E220JW01D; Value: 22pF; Digikey Part Number: 490-5534-1-ND
C32 C33 = GCM21B5c1H120JA37L: Manufacturer: muRata; Tolerance: 5%; Material: C0G; Rated Voltage: 50V; Part Number: GCM21B5c1H120JA37L; Value: 12pF; Digikey Part Number: DO NOT USE FOR NEW DESIGNS
D5#2 = SD560BTR: as D1 on sheet Power Supply; Part Number: SD560BTR; Digikey Part Number: 1655-1530-2-ND; Digikey Link: https://www.digikey.com/product-detail/en/smc-diode-solutions/SD560BTR/1655-1530-2-ND/6022620
D?#1-D?#6 = SML-MN2BCTT86C: LED BLUE CLEAR 2012 SMD; Manufacturer: ROHM Semiconductor; Part Number: SML-MN2BCTT86C; Colour: Blue; Digikey Part Number: 846-1207-1-ND; Digikey Link: https://www.digikey.com/product-detail/en/rohm-semiconductor/SMLMN2BCTT86C/846-1207-1-ND/6057239
K? = TS-1187A-C-D-B: TACTILE SWITCHES SPST 5.10MM X 5.10MM 0.80MM SMD ROHS; Manufacturer: XKB Enerprise; Part Number: TS-1187A-C-D-B; Link: https://jlcpcb.com/client/index.html#/parts/componentSearch?searchTxt=usb
L3 = MMZ2012Y202BTD25: as L1 on sheet CAN; Part Number: MMZ2012Y202BTD25; Value: Ferrite; Digikey Part Number: 445-172872-1-ND
LED1 = SML-211YTT86: Yellow LED Indication - Discrete 1.75V 0805 (2012 Metric); Manufacturer: ROHM Semiconductor; Part Number: SML-211YTT86; Colour: Yellow; Digikey Part Number: 511-1293-1-ND; Digikey Link: https://www.digikey.com/product-detail/en/rohm-semiconductor/SML-211YTT86/511-1293-1-ND/637106
P2 = USB4085-GF-A: USB - C (Type - C) USB 2.0 Receptacle Connector 16 Position Through Hole, Right Angle; Angle: 90; Part Number: USB4085-GF-A; Digikey Part Number: 2073-USB4085-GF-ACT-ND; Digikey Link: https://www.digikey.ee/product-detail/en/gct/USB4085-GF-A/2073-USB4085-GF-ACT-ND/9859733
PCB_NTC1 = NTCS0805E3103FLT: Manufacturer: Vishay Beyschlag; Tolerance: 0.01; Rated Voltage: 210mW; Part Number: NTCS0805E3103FLT; Value: 10K (NTC) (B25/85 3430K); Digikey Part Number: BC2733CT-ND
R4#2 R11 R20 = RC0805FR0710KL: Manufacturer: YAGEO; Tolerance: 0.01; Rated Voltage: 0.125W; Part Number: RC0805FR0710KL; Value: 10k; Material: FR-07; Digikey Part Number: 311-10.0KCRCT-ND
R12-R15 = RC0805FR073K3L: Manufacturer: YAGEO; Tolerance: 0.01; Rated Voltage: 0.125W; Part Number: RC0805FR073K3L; Value: 3.3k; Material: FR-07; Digikey Part Number: 311-3.30KCRCT-ND
R16 R17 = RC0805FR0720RL: Manufacturer: YAGEO; Tolerance: 0.01; Rated Voltage: 0.125W; Part Number: RC0805FR0720RL; Value: 20R; Material: FR-07; Digikey Part Number: 311-20.0CRCT-ND
R18 R19 = RC0805FR075K1L: Manufacturer: YAGEO; Tolerance: 0.01; Rated Voltage: 0.125W; Part Number: RC0805FR075K1L; Value: 5.1k; Material: FR-07; Digikey Part Number: 311-5.10KCRCT-ND
R22-R26 R?#9 R?#10 = RC0805FR070RL: as R4#1 on sheet CAN; Part Number: RC0805FR070RL; Value: 0R; Material: FR-07; Digikey Part Number: 311-0.0CRCT-ND
R?#1-R?#7 = RC0805FR072K2L: Manufacturer: YAGEO; Tolerance: 0.01; Rated Voltage: 0.125W; Part Number: RC0805FR072K2L; Value: 2.2k; Material: FR-07; Digikey Part Number: 311-2.20KCRCT-ND
R?#8 = RC0805FR0751KL: Manufacturer: YAGEO; Tolerance: 0.01; Rated Voltage: 0.125W; Part Number: RC0805FR0751KL; Value: 51k; Material: FR-07; Digikey Part Number: 311-51.0KCRCT-ND
SERIAL1 = TH 2.54mm Header 1x4: Positions: 4; Angle: 0; Flange: No; Contact: NA; Part Number: TH 2.54mm Header 1x4; Pitch: 2.54mm; Row Spacing: 2.54mm
STLINK1 = TH 2.54mm Header 2x5: Positions: 10; Angle: 0; Flange: No; Contact: NA; Part Number: TH 2.54mm Header 2x5; Pitch: 2.54mm; Row Spacing: 2.54mm
TP?#1-TP?#12 = SMD Test Point Small: as TP9 on sheet CAN; Part Number: SMD Test Point Small; Pitch: 0mm; Angle: 0
U8 = STM32F446RET6: ARM® Cortex®-M4 STM32F4 Microcontroller IC 32-Bit 180MHz 512KB (512K x 8) FLASH 64-LQFP (10x10); Manufacturer: STMicroelectronics; Part Number: STM32F446RET6; Digikey Part Number: 497-15376-ND; Digikey Link: https://www.digikey.com.au/product-detail/en/stmicroelectronics/STM32F446RET6/497-15376-ND/5175962
X1 = FC-135 32.7680KA-A5: Manufacturer: EPSON; Load Capacitance: 12.5pF; ESR: 70k; Part Number: FC-135 32.7680KA-A5; Value: 32.768kHz; Digikey Part Number: SER4103TR-ND; Digikey Link: https://www.digikey.com/product-detail/en/epson/FC-135-32.7680KA-A5/SER4103TR-ND/5259895
X2 = ABM8AIG-16.000MHZ-12-2Z-T3: Manufacturer: Abracon LLC; Load Capacitance: 12pF; ESR: 70R; Part Number: ABM8AIG-16.000MHZ-12-2Z-T3; Value: 16MHz; Digikey Part Number: 535-13386-1-ND; Digikey Link: https://www.digikey.com/en/products/detail/abracon-llc/ABM8AIG-16-000MHZ-12-2Z-T3/5817586

## Sheet Accelerometer.SchDoc
size A4; SheetNumber: 5; SheetTotal: 6
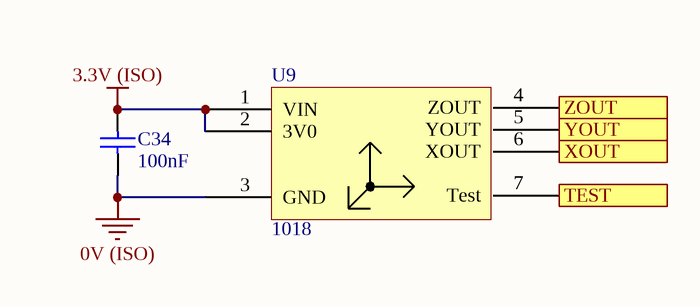
[diagram p4: Accelerometer.SchDoc]

### Parts
C34  100nF  [0805]
U9  1018  [Adafruit 1018]

### Ports
TEST, XOUT (out), YOUT (out), ZOUT (out)

### Nets
0V (ISO): C34.1 U9.3(GND)
3.3V (ISO): C34.2 U9.1(VIN) U9.2(3V0)
NetU9_4: U9.4(ZOUT) ; port ZOUT
NetU9_5: U9.5(YOUT) ; port YOUT
NetU9_6: U9.6(XOUT) ; port XOUT
NetU9_7: U9.7(Test) ; port TEST

### Library data of the parts
C34 = GCM21BR71E104KA37L: as C10 on sheet CAN; Part Number: GCM21BR71E104KA37L; Value: 100nF; Digikey Part Number: DO NOT USE FOR NEW DESIGNS
U9 = 1018: ADXL326 series Accelerometer, 3 Axis Sensor Evaluation Board; Manufacturer: Adafruit; Part Number: 1018; Supplier Part Number: 1528-1011-ND; Link: https://www.digikey.com/en/products/detail/adafruit-industries-llc/1018/4990760

## Sheet Output Drivers1.SchDoc
size A3; SheetNumber: 6; SheetTotal: 6
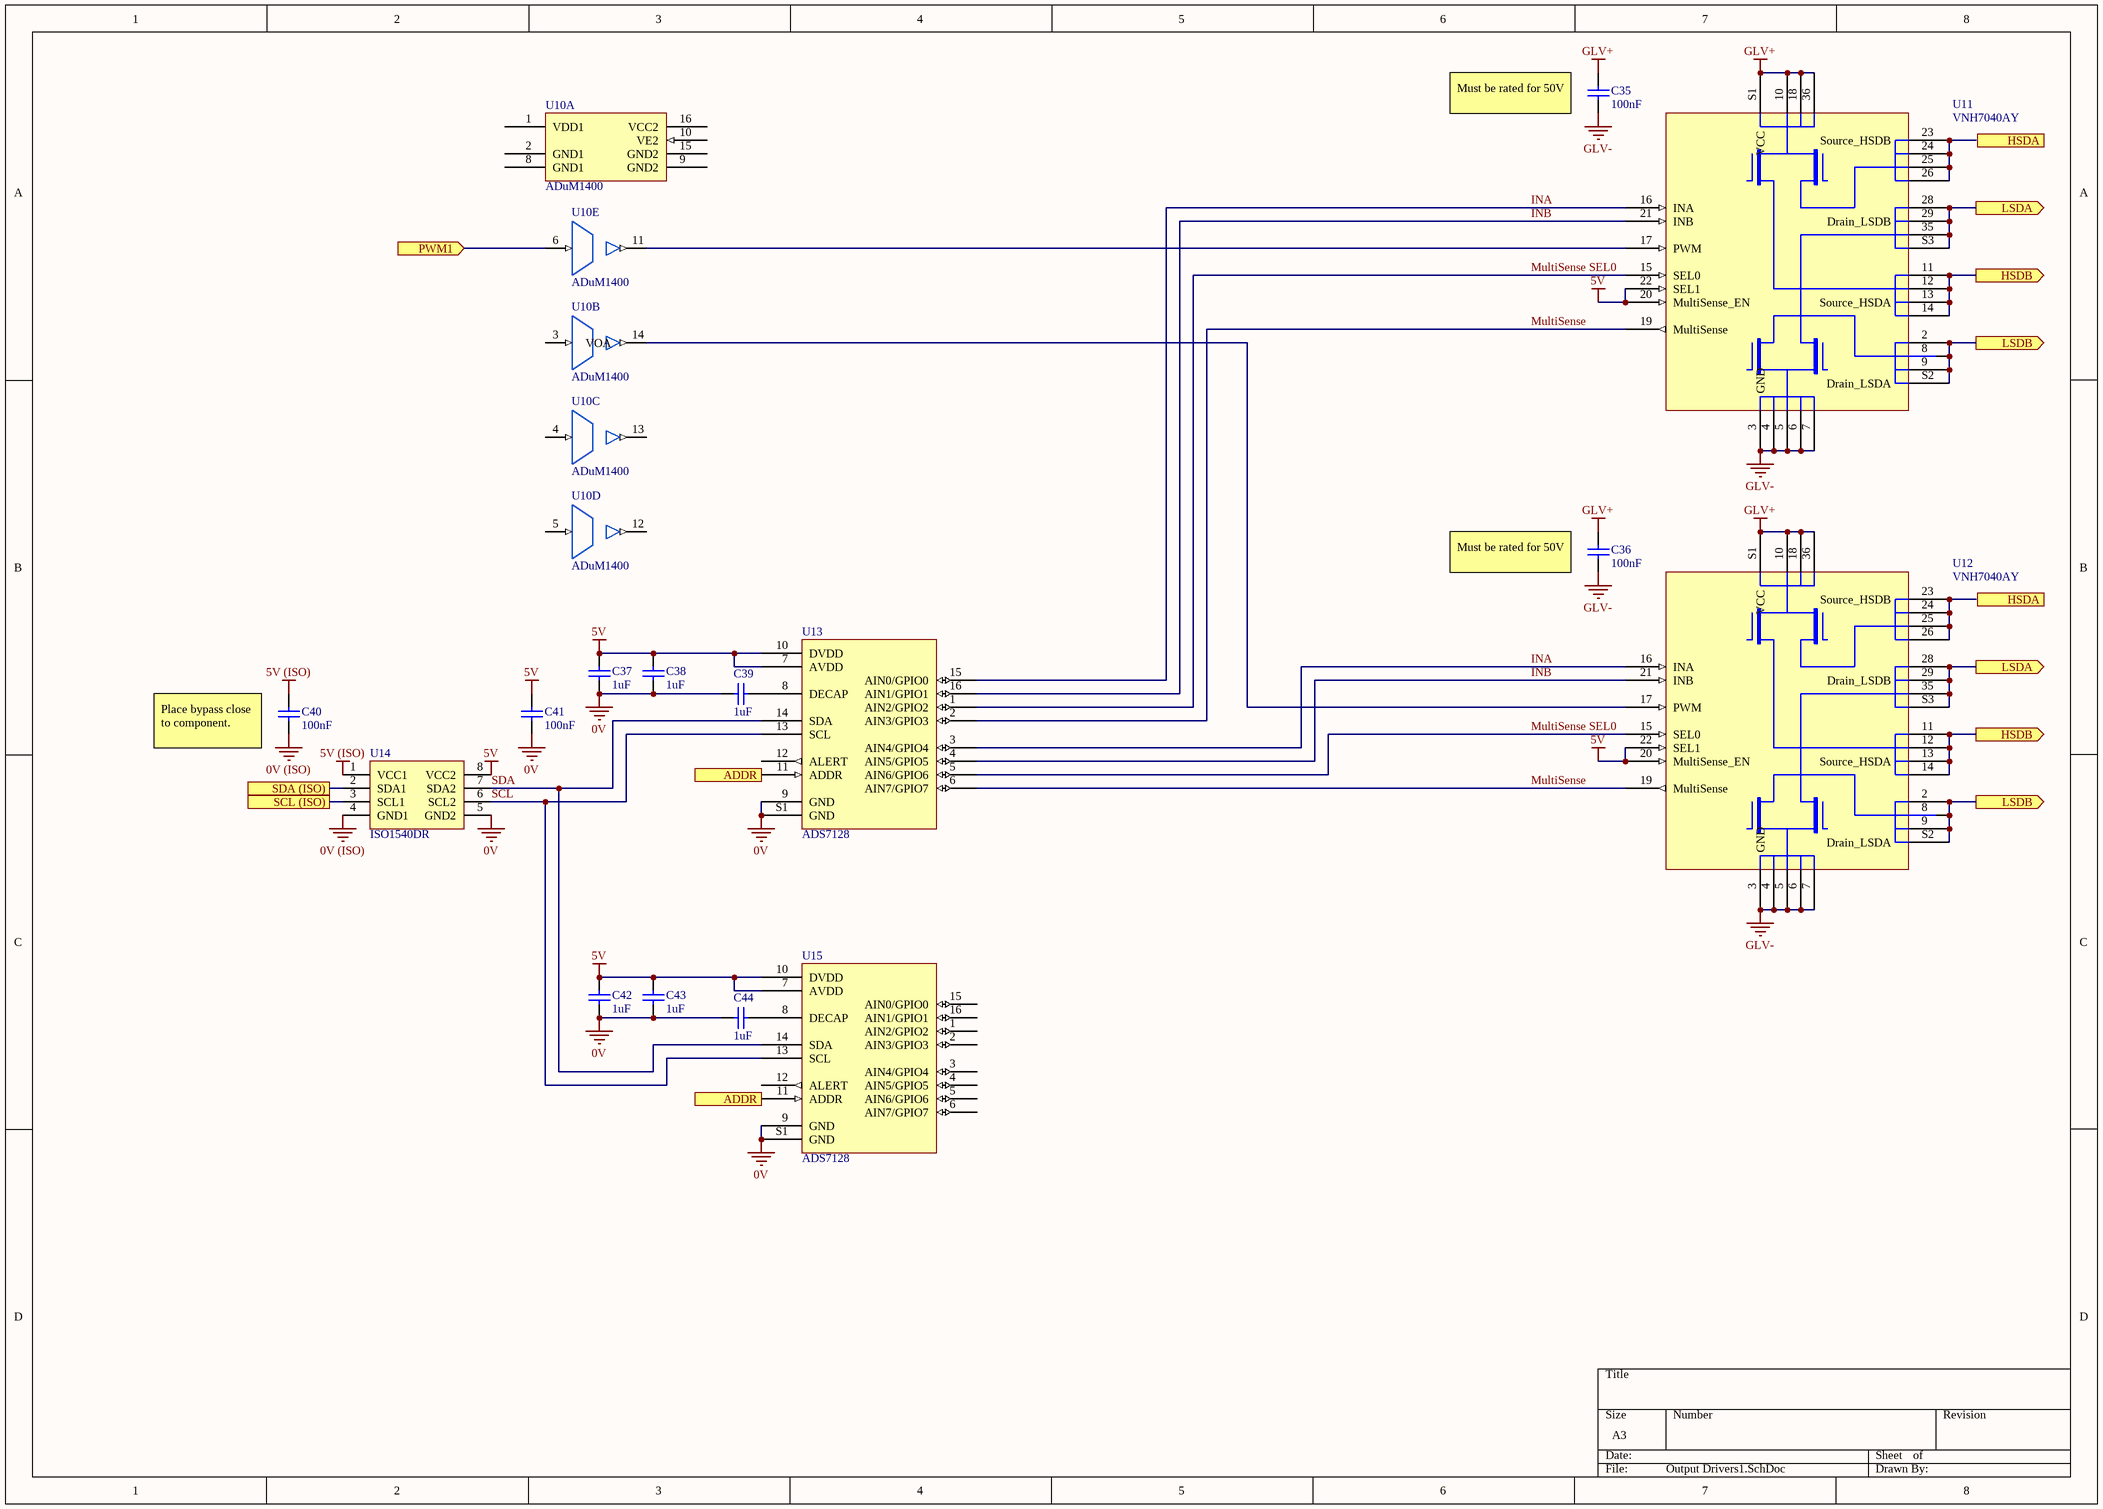
[diagram p5: Output Drivers1.SchDoc]

### Parts
C35  100nF  [0805]
C36  100nF  [0805]
C37  1uF  [0805]
C38  1uF  [0805]
C39  1uF  [0805]
C40  100nF  [0805]
C41  100nF  [0805]
C42  1uF  [0805]
C43  1uF  [0805]
C44  1uF  [0805]
U10  ADuM1400  [AD 16-SOIC]  (parts A,B,C,D,E of 5)
U11  VNH7040AY  [ST PowerSSO-36]
U12  VNH7040AY  [ST PowerSSO-36]
U13  ADS7128  [TI 16-WQFN]
U14  ISO1540DR  [TI 8-SOIC]
U15  ADS7128  [TI 16-WQFN]

### Ports
ADDR (in), HSDA (out), HSDB (out), LSDA (out), LSDB (out), PWM1 (in), SCL (ISO), SDA (ISO)

### Nets
0V: C37.1 C38.1 C39.2 C41.1 C42.1 C43.1 C44.2 U13.9(GND) U13.S1(GND) U14.5(GND2) U15.9(GND) U15.S1(GND)
0V (ISO): C40.1 U14.4(GND1)
5V: C37.2 C38.2 C41.2 C42.2 C43.2 U11.20(MultiSense_EN) U11.22(SEL1) U12.20(MultiSense_EN) U12.22(SEL1) U13.7(AVDD) U13.10(DVDD) U14.8(VCC2) U15.7(AVDD) U15.10(DVDD)
5V (ISO): C40.2 U14.1(VCC1)
GLV+: C35.2 C36.2 U11.10(VCC) U11.18(VCC) U11.36(VCC) U11.S1(VCC) U12.10(VCC) U12.18(VCC) U12.36(VCC) U12.S1(VCC)
GLV-: C35.1 C36.1 U11.3(GND) U11.4(GND) U11.5(GND) U11.6(GND) U11.7(GND) U12.3(GND) U12.4(GND) U12.5(GND) U12.6(GND) U12.7(GND)
INA: U11.16(INA) U12.16(INA) U13.3(AIN4/GPIO4) U13.15(AIN0/GPIO0)
INB: U11.21(INB) U12.21(INB) U13.4(AIN5/GPIO5) U13.16(AIN1/GPIO1)
MultiSense: U11.19(MultiSense) U12.19(MultiSense) U13.2(AIN3/GPIO3) U13.6(AIN7/GPIO7)
MultiSense SEL0: U11.15(SEL0) U12.15(SEL0) U13.1(AIN2/GPIO2) U13.5(AIN6/GPIO6)
SCL: U13.13(SCL) U14.6(SCL2) U15.13(SCL)
SDA: U13.14(SDA) U14.7(SDA2) U15.14(SDA)
NetC39_1: C39.1 U13.8(DECAP)
NetC44_1: C44.1 U15.8(DECAP)
NetU10_6: U10.6(VID) ; port PWM1
NetU10_11: U10.11(VOD) U11.17(PWM)
NetU10_14: U10.14(VOA) U12.17(PWM)
NetU11_2: U11.2(Drain_LSDA) U11.8(Drain_LSDA) U11.9(Drain_LSDA) U11.S2(Drain_LSDA) U12.2(Drain_LSDA) U12.8(Drain_LSDA) U12.9(Drain_LSDA) U12.S2(Drain_LSDA) ; port LSDB
NetU11_11: U11.11(Source_HSDA) U11.12(Source_HSDA) U11.13(Source_HSDA) U11.14(Source_HSDA) U12.11(Source_HSDA) U12.12(Source_HSDA) U12.13(Source_HSDA) U12.14(Source_HSDA) ; port HSDB
NetU11_23: U11.23(Source_HSDB) U11.24(Source_HSDB) U11.25(Source_HSDB) U11.26(Source_HSDB)
NetU11_28: U11.28(Drain_LSDB) U11.29(Drain_LSDB) U11.35(Drain_LSDB) U11.S3(Drain_LSDB) U12.28(Drain_LSDB) U12.29(Drain_LSDB) U12.35(Drain_LSDB) U12.S3(Drain_LSDB) ; port LSDA
NetU12_23: U12.23(Source_HSDB) U12.24(Source_HSDB) U12.25(Source_HSDB) U12.26(Source_HSDB)
NetU13_11: U13.11(ADDR) U15.11(ADDR) ; port ADDR
NetU14_2: U14.2(SDA1) ; port SDA (ISO)
NetU14_3: U14.3(SCL1) ; port SCL (ISO)

Not connected (* = marked no-connect by the designer): U10 1(VDD1) 2(GND1) 3(VIA) 4(VIB) 5(VIC) 8(GND1) 9(GND2) 10(VE2) 12(VOC) 13(VOB) 15(GND2) 16(VCC2); U13 12(ALERT); U15 1(AIN2/GPIO2) 2(AIN3/GPIO3) 3(AIN4/GPIO4) 4(AIN5/GPIO5) 5(AIN6/GPIO6) 6(AIN7/GPIO7) 12(ALERT) 15(AIN0/GPIO0) 16(AIN1/GPIO1)

### Notes on the sheet
- (near C35) Must be rated for 50V
- (near C36) Must be rated for 50V
- (near C40) Place bypass close to component.

### Library data of the parts
C35 C36 C40 C41 = GCM21BR71E104KA37L: as C10 on sheet CAN; Part Number: GCM21BR71E104KA37L; Value: 100nF; Digikey Part Number: DO NOT USE FOR NEW DESIGNS
C37-C39 C42-C44 = AC0805KKX7R8BB105: as C5 on sheet Power Supply; Part Number: AC0805KKX7R8BB105; Value: 1uF; Digikey Part Number: DO NOT USE FOR NEW DESIGNS
U10 = ADuM1400: General Purpose Digital Isolator 2500Vrms 4 Channel 1Mbps 25kV/µs CMTI 16-SOIC (0.295", 7.50mm Width); Manufacturer: Analog Devices; Part Number: ADuM1400; Digikey Part Number: ADUM1400WSRWZ-ND; Digikey Link: https://www.digikey.com/product-detail/en/analog-devices-inc/ADUM1400WSRWZ/ADUM1400WSRWZ-ND/1873713
U11 U12 = VNH7040AY: Motor Driver Power MOSFET PWM PowerSSO-36 TP; Manufacturer: STMicroelectronics; Notes/Alternatives: VNH7070AYTR; Part Number: VNH7040AY; Digikey Part Number: 497-17631-1-ND; Digikey Link: https://www.digikey.com/en/products/detail/stmicroelectronics/VNH7040AYTR/7691019?s=N4IgTCBcDaIG4DsAWB2ADAFjSAugXyA
U13 U15 = ADS7128: 12 Bit Analog to Digital Converter 8 Input 1 SAR 16-WQFN (3x3); Manufacturer: Texas Instruments; Part Number: ADS7128; Digikey Part Number: 296-ADS7128IRTERCT-ND; Digikey Link: https://www.digikey.com/en/products/detail/texas-instruments/ADS7128IRTER/12696006?s=N4IgTCBcDaIIYBMDOB2AjGAHCAugXyA
U14 = ISO1540DR: I2C Digital Isolator (Multichannel); Manufacturer: Texas Instruments; Part Number: ISO1540DR; Digikey Part Number: 296-34871-1-ND; Digikey Link: https://www.digikey.com/product-detail/en/texas-instruments/ISO1540DR/296-34871-1-ND/3587214

## Nets that join several sheets
0V: Power Supply (7 pins), Output Drivers1 (12 pins)
0V (ISO): CAN (9 pins), Power Supply (9 pins), Microcontroller (F446) (39 pins), Accelerometer (C34.1 U9.3), Output Drivers1 (C40.1 U14.4)
3.3V (ISO): CAN (C9.2 C10.2 U5.6), Power Supply (C5.2 D5#1.A TP5.1 U3.5), Microcontroller (F446) (21 pins), Accelerometer (C34.2 U9.1 U9.2)
5V: Power Supply (5 pins), Output Drivers1 (14 pins)
5V (ISO): CAN (C15.2 C16.2 U5.8), Power Supply (7 pins), Microcontroller (F446) (D5#2.K R4#2.2 STLINK1.9 STLINK1.10), Output Drivers1 (C40.2 U14.1)
CANS: Top Level (P1.1), CAN (15 pins)
CANH: Top Level (CAN1.4 CAN2.4 CAN3.4), CAN (C19.2 CAN_TERM_R1.2 TP11.1 U6.1)
CANL: Top Level (CAN1.2 CAN2.2 CAN3.2), CAN (C18.2 CAN_TERM_R2.1 TP10.1 U6.2)
GLV+: Top Level (P1.12), Power Supply (F1.1 TP1.1)
GLV-: Top Level (P1.11), Power Supply (5 pins)